# EasyEDA schematic Briefkastenmelder.json
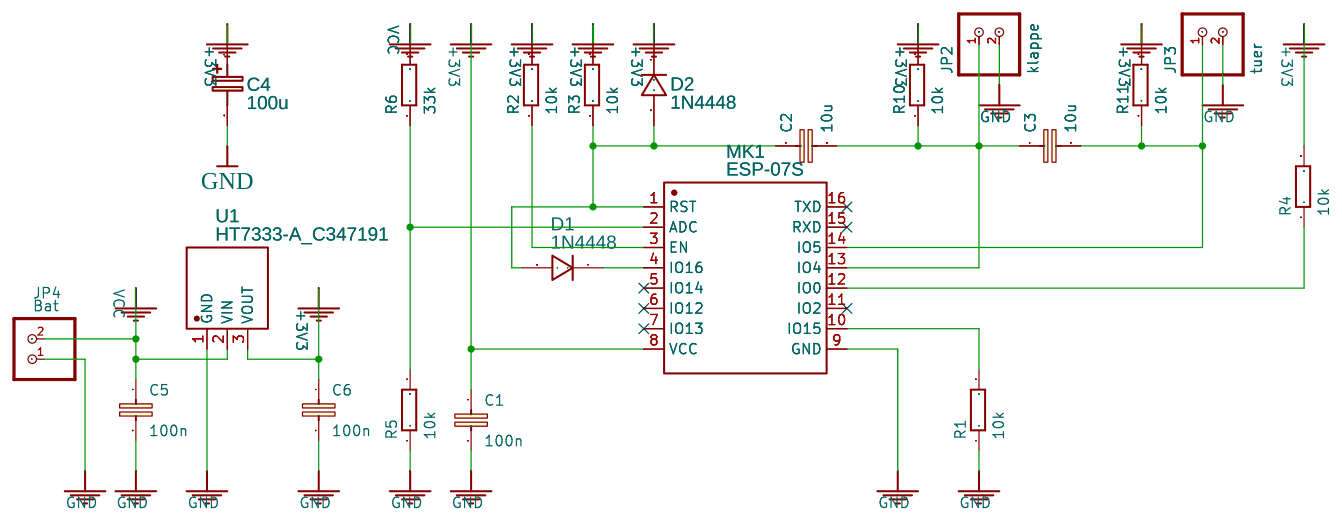
[diagram p0: schematic sheet]

## Parts
C1  100n  [C1206K]
C2  10u  [C1206K]
C3  10u  [C1206K]
C4  100u  [CAP_SMD_10X10_100UF_50V]
C5  100n  [C1206K]
C6  100n  [C1206K]
D1  1N4448  [1N4148W-7-F_FOOTPRINT]
D2  1N4448  [1N4148W-7-F_FOOTPRINT]
JP2  klappe  [1X02]
JP3  tuer  [1X02]
JP4  Bat  [1X02]
MK1  ESP-07S  [WIRELM-SMD_ESP-07S]
R1  10k  [R1206]
R2  10k  [R1206]
R3  10k  [R1206]
R4  10k  [R1206]
R5  10k  [R1206]
R6  33k  [R1206]
R10  10k  [R1206]
R11  10k  [R1206]
U1  HT7333-A_C347191  [SOT-89-3_L4.5-W2.5-P1.50-LS4.2-BR]

## Library data of the parts
C4 = Cap_Electrolytic(TH)_D6.3XF2.5_EU: Contributor: EasyEDA
D1 D2 = -: Supplier: LCSC; Manufacturer: SEMTECH; image: //image.lceda.cn/szlcsc/C54037.jpg; Supplier Part: C54037
MK1 = -: Supplier: LCSC; Manufacturer: Ai-Thinker; Supplier Part: C82895
U1 = HT7333-A_C347191: Supplier: LCSC; Supplier Part: C347191; Manufacturer: Youtai Semiconductor Co., Ltd.; Manufacturer Part: HT7333-A; Contributor: LCSC

## Nets
+3V3: C1.1 C4.1 C6.1 D2.1(K) MK1.8(VCC) R2.2 R3.2 R4.2 R10.2 R11.2 U1.3(VOUT)
GND: C1.2 C4.2 C5.2 C6.2 JP2.2 JP3.2 JP4.1 MK1.9(GND) R1.1 R5.1 U1.1(GND)
VCC: C5.1 JP4.2 R6.2 U1.2(VIN)
Net-(C2-1): C2.1 D1.2(A) D2.2(A) MK1.1(RST) R3.1
Net-(C2-2): C2.2 C3.1 JP2.1 MK1.13(IO4) R10.1
Net-(C3-2): C3.2 JP3.1 MK1.14(IO5) R11.1
Net-(D1-1): D1.1(K) MK1.4(IO16)
Net-(MK1-2): MK1.2(ADC) R5.2 R6.1
Net-(MK1-3): MK1.3(EN) R2.1
Net-(MK1-10): MK1.10(IO15) R1.2
Net-(MK1-12): MK1.12(IO0) R4.1

Not connected (* = marked no-connect by the designer): MK1 5(IO14)* 6(IO12)* 7(IO13)* 11(IO2)* 15(RXD)* 16(TXD)*
